# Altium schematic sheet Sheet1.SchDoc
size 350 x 199 mm; SheetNumber: 1; SheetTotal: 1
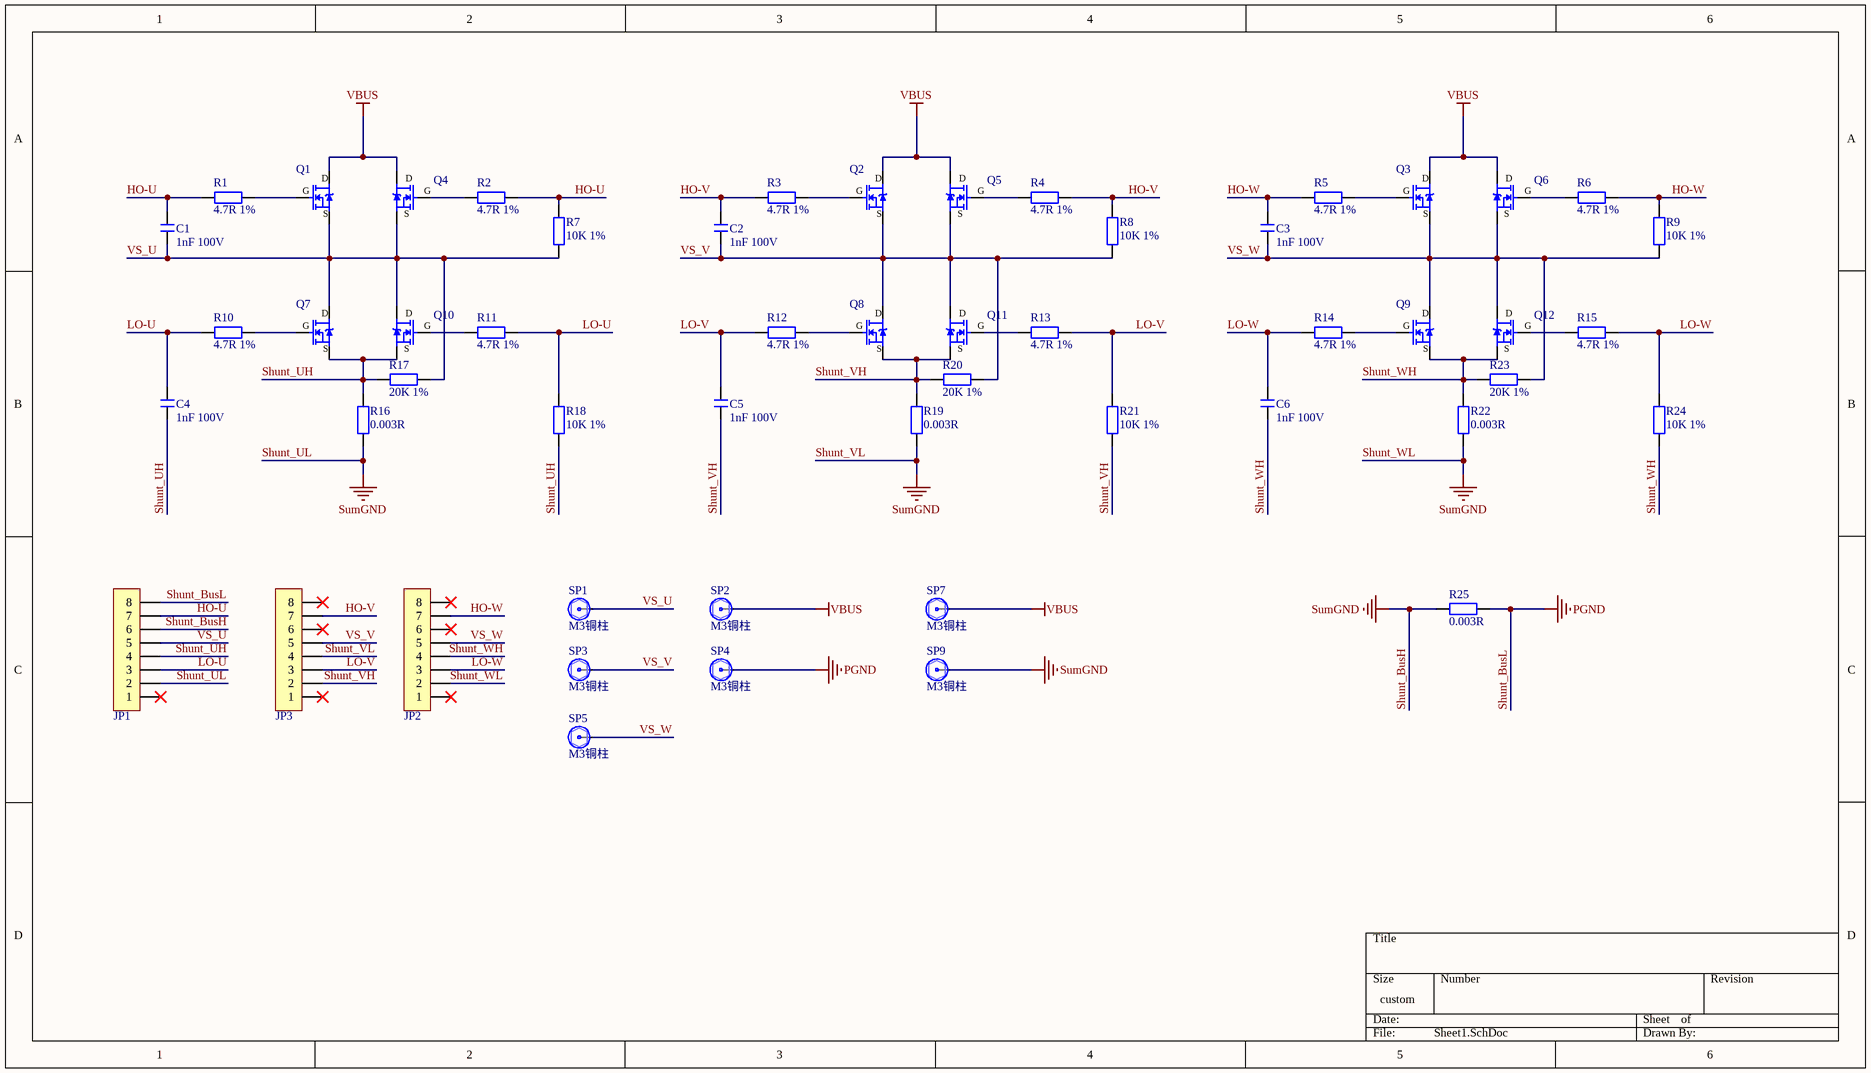
[diagram p0: Sheet1.SchDoc]

## Parts
C1  1nF 100V  [C0603_l]
C2  1nF 100V  [C0603_l]
C3  1nF 100V  [C0603_l]
C4  1nF 100V  [C0603_l]
C5  1nF 100V  [C0603_l]
C6  1nF 100V  [C0603_l]
JP1  HDR-1X8  [贴片排针2.54mm_交错_8P]  (value not drawn)
JP2  HDR-1X8  [贴片排针2.54mm_交错_8P]  (value not drawn)
JP3  HDR-1X8  [贴片排针2.54mm_交错_8P]  (value not drawn)
Q1  Nmos_TOLL8  [TOLL-8]  (value not drawn)
Q2  Nmos_TOLL8  [TOLL-8]  (value not drawn)
Q3  Nmos_TOLL8  [TOLL-8]  (value not drawn)
Q4  Nmos_TOLL8  [TOLL-8]  (value not drawn)
Q5  Nmos_TOLL8  [TOLL-8]  (value not drawn)
Q6  Nmos_TOLL8  [TOLL-8]  (value not drawn)
Q7  Nmos_TOLL8  [TOLL-8]  (value not drawn)
Q8  Nmos_TOLL8  [TOLL-8]  (value not drawn)
Q9  Nmos_TOLL8  [TOLL-8]  (value not drawn)
Q10  Nmos_TOLL8  [TOLL-8]  (value not drawn)
Q11  Nmos_TOLL8  [TOLL-8]  (value not drawn)
Q12  Nmos_TOLL8  [TOLL-8]  (value not drawn)
R1  4.7R 1%  [r0603_l]
R2  4.7R 1%  [r0603_l]
R3  4.7R 1%  [r0603_l]
R4  4.7R 1%  [r0603_l]
R5  4.7R 1%  [r0603_l]
R6  4.7R 1%  [r0603_l]
R7  10K 1%  [r0603_l]
R8  10K 1%  [r0603_l]
R9  10K 1%  [r0603_l]
R10  4.7R 1%  [r0603_l]
R11  4.7R 1%  [r0603_l]
R12  4.7R 1%  [r0603_l]
R13  4.7R 1%  [r0603_l]
R14  4.7R 1%  [r0603_l]
R15  4.7R 1%  [r0603_l]
R16  0.003R  [R3920]
R17  20K 1%  [r0603_l]
R18  10K 1%  [r0603_l]
R19  0.003R  [R3920]
R20  20K 1%  [r0603_l]
R21  10K 1%  [r0603_l]
R22  0.003R  [R3920]
R23  20K 1%  [r0603_l]
R24  10K 1%  [r0603_l]
R25  0.003R  [R3920]
SP1  M3铜柱  [内嵌螺母M3*7*5]
SP2  M3铜柱  [内嵌螺母M3*7*5]
SP3  M3铜柱  [内嵌螺母M3*7*5]
SP4  M3铜柱  [内嵌螺母M3*7*5]
SP5  M3铜柱  [内嵌螺母M3*7*5]
SP7  M3铜柱  [内嵌螺母M3*7*5]
SP9  M3铜柱  [内嵌螺母M3*7*5]

## Nets
Shunt_BusH: JP1.2 JP1.6 JP2.2 JP3.4 R16.1 R19.1 R22.1 R25.2 SP9.1  [also labelled Shunt_UL, Shunt_VL, Shunt_WL, SumGND]
Shunt_BusL: JP1.8 R25.1 SP4.1  [also labelled PGND]
VBUS: Q1.3(D) Q2.3(D) Q3.3(D) Q4.3(D) Q5.3(D) Q6.3(D) SP2.1 SP7.1
HO-U: C1.2 JP1.7 R1.2 R2.1 R7.1
HO-V: C2.2 JP3.7 R3.2 R4.1 R8.1
HO-W: C3.2 JP2.7 R5.2 R6.1 R9.1
LO-U: C4.2 JP1.3 R10.2 R11.1 R18.1
LO-V: C5.2 JP3.3 R12.2 R13.1 R21.1
LO-W: C6.2 JP2.3 R14.2 R15.1 R24.1
Shunt_UH: C4.1 JP1.4 Q7.2(S) Q10.2(S) R16.2 R17.1 R18.2
Shunt_VH: C5.1 JP3.2 Q8.2(S) Q11.2(S) R19.2 R20.2 R21.2
Shunt_WH: C6.1 JP2.4 Q9.2(S) Q12.2(S) R22.2 R23.1 R24.2
VS_U: C1.1 JP1.5 Q1.2(S) Q4.2(S) Q7.3(D) Q10.3(D) R7.2 R17.2 SP1.1
VS_V: C2.1 JP3.5 Q2.2(S) Q5.2(S) Q8.3(D) Q11.3(D) R8.2 R20.1 SP3.1
VS_W: C3.1 JP2.5 Q3.2(S) Q6.2(S) Q9.3(D) Q12.3(D) R9.2 R23.2 SP5.1
NetQ1_1: Q1.1(G) R1.1
NetQ2_1: Q2.1(G) R3.1
NetQ3_1: Q3.1(G) R5.1
NetQ4_1: Q4.1(G) R2.2
NetQ5_1: Q5.1(G) R4.2
NetQ6_1: Q6.1(G) R6.2
NetQ7_1: Q7.1(G) R10.1
NetQ8_1: Q8.1(G) R12.1
NetQ9_1: Q9.1(G) R14.1
NetQ10_1: Q10.1(G) R11.2
NetQ11_1: Q11.1(G) R13.2
NetQ12_1: Q12.1(G) R15.2

Not connected (* = marked no-connect by the designer): JP1 1*; JP2 1* 6* 8*; JP3 1* 6* 8*

## Library data of the parts
C1-C6 = C: 无极性贴片电容; 版权归属: 源创客; 材质: X7R; BOM名称: 无极性贴片电容; 学习资源: www.ooocke.com
JP1-JP3 = Header 8: 8P接插件; 版权归属: 源创客; BOM名称: 8P接插件; 学习资源: www.ooocke.com
R1-R25 = R: 贴片电阻; 版权归属: 源创客; BOM名称: 贴片电阻; 学习资源: www.ooocke.com
SP1-SP5 SP7 SP9 = 铜柱大焊盘: 铜柱; 版权归属: 源创客; BOM名称: 铜柱; 学习资源: www.ooocke.com